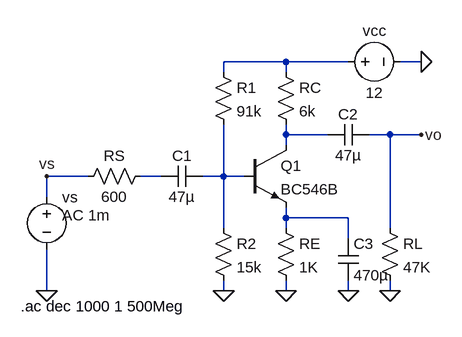
[diagram p0: schematic Amplificador.asc]
Amplificador.asc, the LTspice schematic file:
Version 4
SHEET 1 880 680
WIRE 96 -80 0 -80
WIRE 192 -80 96 -80
WIRE 304 -80 272 -80
WIRE 0 -64 0 -80
WIRE 96 -64 96 -80
WIRE 96 32 96 16
WIRE 160 32 96 32
WIRE 256 32 224 32
WIRE 304 32 256 32
WIRE 96 48 96 32
WIRE -208 96 -272 96
WIRE -96 96 -128 96
WIRE 0 96 0 16
WIRE 0 96 -32 96
WIRE 32 96 0 96
WIRE -272 128 -272 96
WIRE 96 160 96 144
WIRE 192 160 96 160
WIRE 0 176 0 96
WIRE 96 176 96 160
WIRE 256 176 256 32
WIRE 192 192 192 160
WIRE -272 272 -272 208
WIRE 0 272 0 256
WIRE 96 272 96 256
WIRE 192 272 192 256
WIRE 256 272 256 256
FLAG 304 -80 0
FLAG -272 272 0
FLAG 0 272 0
FLAG 96 272 0
FLAG 192 272 0
FLAG 256 272 0
FLAG 304 32 vo
FLAG -272 96 vs
SYMBOL voltage -272 112 R0
WINDOW 3 -40 -94 Left 2
WINDOW 123 24 44 Left 2
WINDOW 39 0 0 Left 0
SYMATTR Value ""
SYMATTR Value2 AC 1m
SYMATTR InstName vs
SYMBOL cap -32 80 R90
WINDOW 0 0 32 VBottom 2
WINDOW 3 32 32 VTop 2
SYMATTR InstName C1
SYMATTR Value 47µ
SYMBOL res -16 -80 R0
SYMATTR InstName R1
SYMATTR Value 91k
SYMBOL res -16 160 R0
SYMATTR InstName R2
SYMATTR Value 15k
SYMBOL res 80 -80 R0
SYMATTR InstName RC
SYMATTR Value 6k
SYMBOL res 80 160 R0
SYMATTR InstName RE
SYMATTR Value 1K
SYMBOL cap 224 16 R90
WINDOW 0 0 32 VBottom 2
WINDOW 3 32 32 VTop 2
SYMATTR InstName C2
SYMATTR Value 47µ
SYMBOL cap 176 192 R0
SYMATTR InstName C3
SYMATTR Value 470µ
SYMBOL res 240 160 R0
SYMATTR InstName RL
SYMATTR Value 47K
SYMBOL voltage 176 -80 R270
WINDOW 0 32 56 VTop 2
WINDOW 3 -32 56 VBottom 2
SYMATTR InstName vcc
SYMATTR Value 12
SYMBOL res -112 80 R90
WINDOW 0 0 56 VBottom 2
WINDOW 3 32 56 VTop 2
SYMATTR InstName RS
SYMATTR Value 600
SYMBOL npn 32 48 R0
SYMATTR InstName Q1
SYMATTR Value BC546B
TEXT -312 296 Left 2 !.ac dec 1000 1 500Meg

The netlist it stands for:
* Amplificador.asc
vs vs 0 AC 1m
C1 N004 N003 47µ
R1 N001 N004 91k
R2 N004 0 15k
RC N001 N002 6k
RE N005 0 1K
C2 vo N002 47µ
C3 N005 0 470µ
RL vo 0 47K
vcc N001 0 12
RS N003 vs 600
Q1 N002 N004 N005 0 BC546B
.model NPN NPN
.model PNP PNP
.lib standard.bjt
.ac dec 1000 1 500Meg
.backanno
.end